# Altium project TX-10 Prototype.PrjPcb
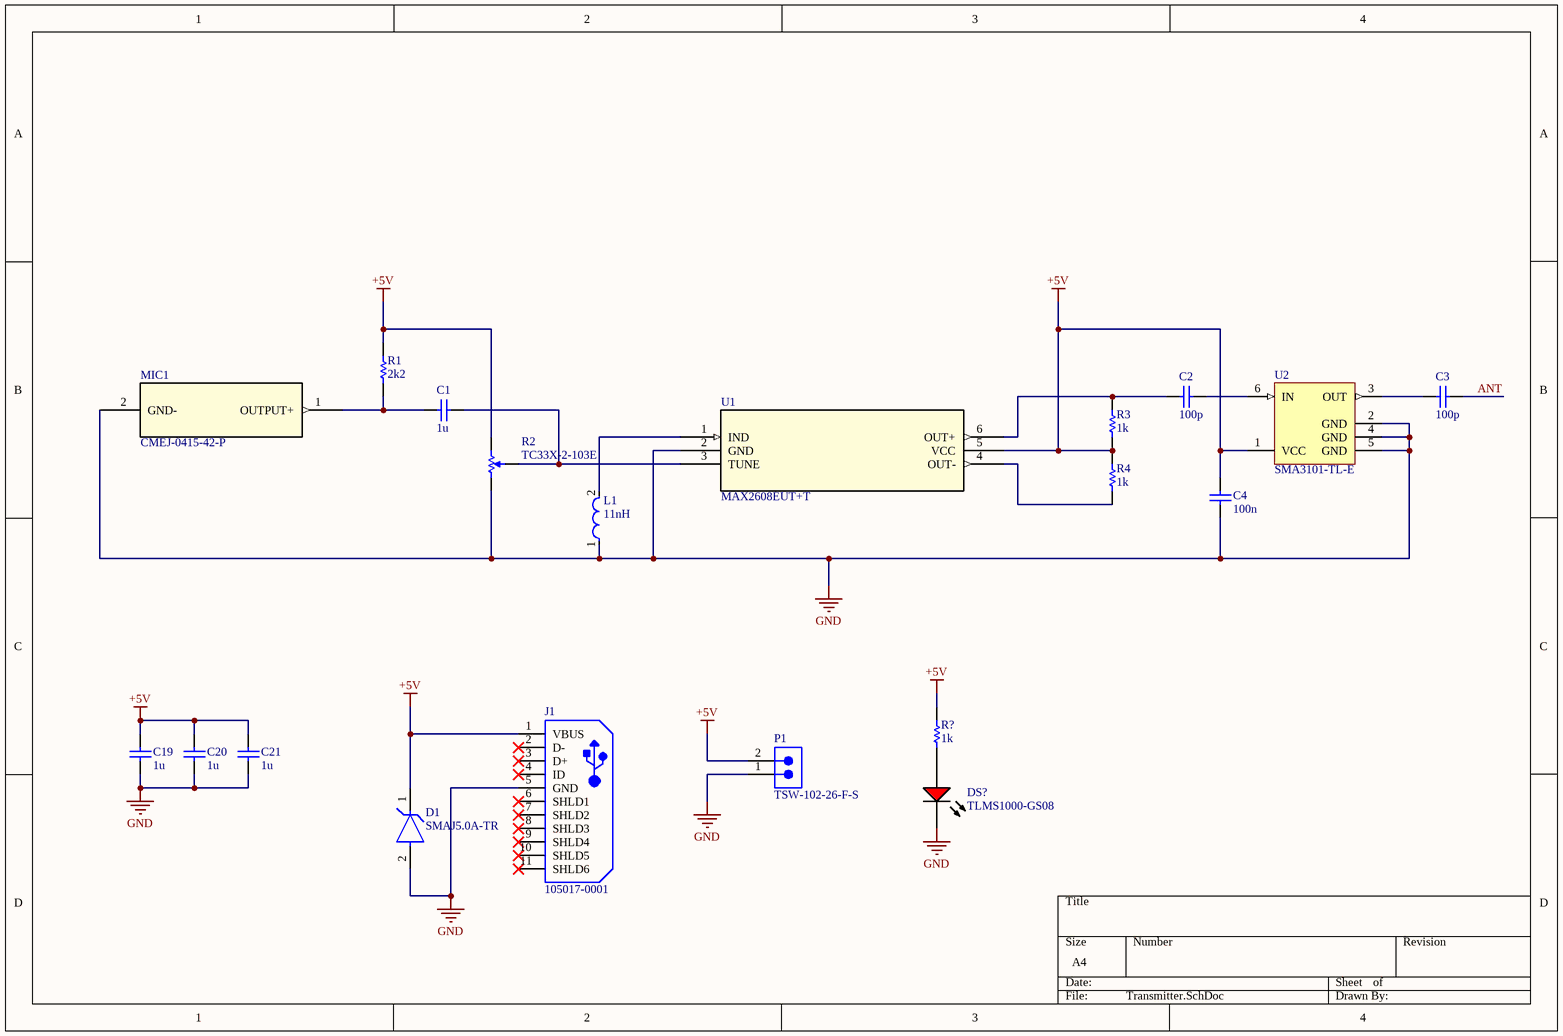
[diagram p0: Transmitter.SchDoc]
2 sheets, 64 parts. Net scope: global (net labels, ports and power ports of the same name join across sheets).
Board files: ReceiverPCB.PcbDoc, TransmitterPCB.PcbDoc
Sheets:
  Transmitter.SchDoc
  Receiver.SchDoc

## Sheet Transmitter.SchDoc
size A4; SheetNumber: 1; SheetTotal: 2

### Parts
C1  1u  [CAPC1608X90X35ML10T15]
C2  100p  [CAPC1608X90X35ML10T15]
C3  100p  [CAPC1608X90X35ML10T15]
C4  100n  [CAPC1608X90X35ML10T15]
C19  1u  [CAPC1608X90X35ML10T15]
C20  1u  [CAPC1608X90X35ML10T15]
C21  1u  [CAPC1608X90X35ML10T15]
D1  SMAJ5.0A-TR  [FP-SMA-MFG]
DS?  TLMS1000-GS08  [VISH-TLMS1000_V]
J1  105017-0001  [USB-MICRO-B_V]
L1  11nH  [FP-SRN2512-MFG]
MIC1  CMEJ-0415-42-P  [CMEJ-0415_CUD]
P1  TSW-102-26-F-S  [SMTC-TSW-102-26-XX-S]
R1  2k2  [RESC1608X55X25ML10T15]
R2  TC33X-2-103E  [BOUR-TC33X-2_V]
R3  1k  [RESC1608X55X25ML10T15]
R4  1k  [RESC1608X55X25ML10T15]
R?  1k  [RESC1608X55X25ML10T15]
U1  MAX2608EUT+T  [21-0058I_MXM]
U2  SMA3101-TL-E  [ONSC-MCPH-6_V]

### Nets
+5V: C4.2 C19.2 C20.2 C21.2 D1.1(K) J1.1(VBUS) P1.2 R1.2 R2.3 R3.1 R4.2 R?.1 U1.5(VCC) U2.1(VCC)
GND: C4.1 C19.1 C20.1 C21.1 D1.2(A) DS?.2(K) J1.5(GND) L1.1 MIC1.2(GND-) P1.1 R2.1 U1.2(GND) U2.2(GND) U2.4(GND) U2.5(GND)
ANT: C3.2
NetC1_1: C1.1 MIC1.1(OUTPUT+) R1.1
NetC1_2: C1.2 R2.2 U1.3(TUNE)
NetC2_1: C2.1 R3.2 U1.6(OUT+)
NetC2_2: C2.2 U2.6(IN)
NetC3_1: C3.1 U2.3(OUT)
NetDS?_1: DS?.1(A) R?.2
NetL1_2: L1.2 U1.1(IND)
NetR4_1: R4.1 U1.4(OUT-)

Not connected (* = marked no-connect by the designer): J1 2(D-)* 3(D+)* 4(ID)* 6(SHLD1)* 7(SHLD2)* 8(SHLD3)* 9(SHLD4)* 10(SHLD5)* 11(SHLD6)*

### Library data of the parts
C1-C4 C19-C21 = CMP-2100-03643-1: Chip Capacitor, 0.1 uF, +/- 10%, 50 V, -55 to 125 degC, 0603 (1608 Metric), RoHS, Tape and Reel; Manufacturer: Murata; Dielectric Material: Ceramic; Voltage Rating: 50V; Capacitance: 100nF; Dielectric: X7R; Insulation Resistance: 10GR; Case Code (Metric): 1608; Lead Free: LeadFree; Depth: 0.8mm; Number of Pins: 2; Radiation Hardening: No; Case/Package: 0603; Manufacturer URL: http://www.murata.com/; Packaging: TapeandReel; Length: 1.6mm; Contact Plating: Tin; Datasheet URL: http://psearch.en.murata.com/capacitor/product/GRM188R71H104KA93%23.pdf; Tolerance: 10%; Case Code (Imperial): 0603; Min Operating Temperature: -55degC; RoHSCompliant: true; Voltage: 50V; Termination: SMD/SMT; Mount: SurfaceMount; Material: Ceramic; Package Quantity: 1; Height: 0.8mm; Thickness: 0.035inch; REACH SVHC: NoSVHC; Max Operating Temperature: 125degC; Width: 0.8mm; Package Reference: 0603; Voltage Rating (DC): 50V; Datasheet Version: 42675.0; Package Description: 2-Pin Surface Mount Device, Body 1.6 x 0.8 mm
D1 = CMP-12225-000048-1: TVS DIODE 5V 13.4V SMA; Manufacturer: STMicroelectronics; Standoff Height: 0.05mm; Max Junction Temp: +150°C; Clamping Voltage: 9.2V; Number Of Channels: 1; Peak Pulse Power: 400W; Peak Pulse Current: 43.5A; Breakdown Voltage: 6.4V; Direction: Unidirectional; ComponentLink2Description: Datasheet; Lead Free: Yes; Package: SMA; Height: 2.65mm; Mouser Description: Transient Voltage Suppressor, TVS, Transil SMAJ Series, Unidirectional, 5 V, DO-214AC, 2, 6.4 V; Manufacturer Part Number: SMAJ5.0A-TR; Reverse Standoff Voltage: 5V; Temperature Range Low: -55°C; Device Class L1: Circuit Protection; RoHS: TRUE; Category: Diode; Automotive: No; ComponentLink2URL: https://www.st.com/resource/en/datasheet/smaj.pdf; Device Class L3: unset; Device Class L2: TVS Diodes; Temperature Range High: +150°C; Octopart: https://octopart.com/smaj5.0a-tr-stmicroelectronics-347063; Digikey Description: TVS DIODE 5V 13.4V SMA; Temperature: -55°C to +150°C
DS? = CMP-2000-07254-1: Low Current LED, 40 mW, 1.8 V, -40 to 100 degC, 2-Pin SMD (0603), RoHS, Tape and Reel; Manufacturer: Vishay; Lens Shape: Rectangular; Automotive Qualification Standard: AEC-Q100; Wavelength Typ: 636nm; SVHC: ToBeAdvised; LED Colour: Red; Bulb Size: 1.6mmx0.8mm; Forward Voltage: 1.8V; Luminous Intensity: 4mcd; Forward Current If: 2mA; Viewing Angle: 80°; Datasheet Version: Rev. 1.7, 02/2011; Datasheet URL: https://datasheet.ciiva.com/5798/1698881-5798337.pdf; LED Mounting: SMD; Packaging: CutTape; Package Reference: TLMS1000; Manufacturer URL: http://www.vishay.com/; Mounting Technology: SurfaceMount; Product Range: -; Package Description: 2-Pin Surface Mount Device, Body 1.6 x 0.8 mm; MSL: MSL2-1year
J1 = CMP-2000-05827-1: Micro-USB B Receptacle, Right Angle, Bottom Mount, Surface Mount, with Solder Tabs, -30 to 85 degC, 5-Pin USB, RoHS, Tape and Reel; Manufacturer: Molex; Featured Product: Micro-USBConnectorsUSBConnectors; Other Names: WM1399DKR; Package Version: Rev. F, 12/2012; Number of Contacts: 5; Connector Type: USB-microB; Catalog Drawings: 1050170001; 3D Model: 105017-0001.stp; Mating Products: WM17145-ND-CABLEMICROUSBBTOSTDA1.0MWM17147-ND-CABLEMICROUSBBTOSTDA2.0MWM17146-ND-CABLEMICROUSBBTOSTDA1.5M; PCN Assembly/Origin: ResinSupplier21/Oct/2015; Voltage - Max: 30V; Online Catalog: Molex-MicroUSB; Manufacturer URL: http://www.molex.com/; Package Description: 5-Leads USB, Micro B, Body 7.5 x 5 mm, Pitch 0.65 mm; Datasheet URL: http://www.molex.com/elqNow/elqRedir.htm?ref=http://www.molex.com/webdocs/datasheets/pdf/en-us/1050170001_IO_CONNECTORS.pdf; Ingress Protection: -; Datasheet Version: 03/2016; Mounting Type: BoardCutout,SurfaceMount,RightAngle; Circuits: 5; Standard Package: 1; Package Reference: MICRO-B; Package URL: http://www.molex.com/pdm_docs/sd/1050170001_sd.pdf; Category: Connectors,Interconnects; Series: -; RoHS Information: 1050170001CertofCompliance; Features: Shielded,SolderRetention; Family: USB,DVI,HDMIConnectors; Specifications: -; Gender: Receptacle; Packaging: Digi-Reel®; Mounting Technology: SurfaceMount
L1 = CMP-07248-000049-1: FIXED IND 240NH 4.7A 24 MOHM SMD; Inductance Tolerance: 20%; Core Material: Ferrite; Shielding: Shielded; Self Resonant Frequency: 330MHz; Test Frequency: 1MHz; DC Resistance (DCR): 24mR; Saturation Current: 8A; Package Quantity: 2000; Depth: 2mm; Case Code (Metric): 2520; Case Code (Imperial): 1008; Max DC Current: 4.7A; Width: 0.079inch; Weight: 0.001058oz; Current Rating: 4.7A; Tolerance: 20%; Mount: Surface Mount; Height - Seated (Max): 0.047inch; Min Operating Temperature: -55°C; Inductance: 240nH; RMS Current (Irms): 4.7A; REACH SVHC: No SVHC; Max Operating Temperature: 125°C; Length: 2.5mm; Packaging: Tape and Reel; Height: 1.2mm; Case/Package: 1008; Resistor Type: Wirewound; Termination: SMD/SMT; RoHS Compliant: Yes
MIC1 = CMEJ-0415-42-P: No Description Available; Mfr_Name: Same Sky; RefDes: RefDes; Type: Type
P1 = CMP-1024-00329-1: 0.025" SQ Post Header, Through-hole, Vertical, -55 to 125 degC, 2.54 mm Pitch, 2-Pin, Male, RoHS; Manufacturer: Samtec; Pitch: 2.54 mm; PackageVersion: DM, 8/1988; ComponentLink2Description: Datasheet; PackageReference: TSW-102-26-XX-S; ComponentLink3URL: http://www.samtec.com/documents/webfiles/cpdf/TSW-XXX-XX-XXX-X-XX-XXX-MKT.pdf; ComponentLink2URL: http://www.samtec.com/documents/webfiles/pdf/TSW_TH.PDF; ComponentLink1Description: Manufacturer URL; DatasheetVersion: F-214; RoHS: True; ComponentLink3Description: Package Specification; PartNumber: TSW-102-26-F-S; Temperature Range: -55 to 125 degC; Orientation: Vertical; ComponentLink1URL: http://www.samtec.com; PackageDescription: .025[0.64] SQ. Post Terminal Strip Assembly; Mounting Technology: Through-hole
R1 R3 R4 R? = CMP-2100-03667-1: Chip Resistor, 0 Ohm, +/- 5%, 0.1 W, -55 to 155 degC, 0603 (1608 Metric), RoHS, Tape and Reel; Manufacturer: Yageo; Temperature Coefficient: 200ppm/degreesC; Voltage Rating: 50V; Power Rating: 100mW; Resistance: 0mOhm; Width: 0.8mm; Max Operating Temperature: 155degC; Tolerance: 5%; Package Reference: 0603; Height: 0.45mm; Depth: 0.8mm; Package Description: 2-Pin Surface Mount Device, Body 1.6 x 0.8 mm; Termination: SMD/SMT; Package Quantity: 5000; Case/Package: 0603; Case Code (Imperial): 0603; Radiation Hardening: No; Number of Pins: 2; Length: 1.6mm; Lead Free: LeadFree; Voltage Rating (DC): 50V; Military Standard: Not; Datasheet URL: http://www.yageo.com/NewPortal/yageodocoutput?fileName=/pdf/R-Chip/PYu-RC_Group_51_RoHS_L_5.pdf; Manufacturer URL: http://www.yageo.com/; Packaging: TapeandReel; Case Code (Metric): 1608; Min Operating Temperature: -55degC; Composition: ThickFilm; RoHSCompliant: true; Contact Plating: Tin; Datasheet Version: Rev. 5, 10/2016; REACH SVHC: NoSVHC
R2 = CMP-2100-03695-1: Trimming Potentiometer, 10000 Ohm, -40 to 100 degC, 3-Pin SMD, RoHS, Tape and Reel; Manufacturer: Bourns; Tolerance: 25%; Max Power Dissipation: 100mW; Number of Turns: 1; Resistance: 10KOhm; Temperature Coefficient: 250ppm/degreesC; Voltage Rating (DC): 50V; Datasheet URL: http://www.bourns.com/docs/Product-Datasheets/TC33.pdf; Composition: Potentiometer; Package Description: 3-Pin Surface Mount Device, Body 3.8 x 3.6 mm; Weight: 29.4mg; Power Rating: 100mW; Termination: FootPrint; Manufacturer URL: http://www.bourns.com/; Width: 0.118inch; Height: 0.047inch; Military Standard: Not; Radiation Hardening: No; Colour: Silver; Case/Package: SMD/SMT; Depth: 3.8mm; Min Operating Temperature: -40degC; Lead Free: LeadFree; Datasheet Version: 42583.0; REACH SVHC: NoSVHC; Length: 3mm; RoHSCompliant: true; Contact Plating: Silver; Taper: Linear; Packaging: TapeandReel; Mount: SurfaceMount; Max Operating Temperature: 100degC; Package Reference: TC33X-2; Package Quantity: 2500
U1 = MAX2608EUT+T: No Description Available; Mfr_Name: Analog Devices / Maxim Integrated; RefDes: RefDes; Type: Type
U2 = CMP-1314-00002-1: MMIC, Amplifier, 5 V, 10 mA, 0.1 to 3 GHz, 4.5 to 5.5 V, -40 to 85 degC, 6-Pin MCPH, Pb-Free, Tape and Reel; Manufacturer: On Semiconductor; Power Gain Min (dB): 21.5; Upper Freq (3 dB) (GHz): 3; ICC Min (mA): 7.1; VCC Min (V): 4.5; Power Gain Max (dB): 28.5; ICC Max (mA): 12.6; VCC Max (V): 5.5; Noise Figure Max (dB): 5.3; ComponentLink3Description: Package Specification; ComponentLink3URL: http://www.onsemi.com/pub_link/Collateral/ENA1601-D.PDF; PackageDescription: 6-Pin Small Outline Transistor, Body 2 x 1.6 mm, Pitch 0.65 mm; PartNumber: SMA3101-TL-E; ComponentLink2Description: Datasheet; ComponentLink2URL: http://www.onsemi.com/pub_link/Collateral/ENA1431A-D.PDF; RoHS: TRUE; Packing: Tape and Reel; ComponentLink1URL: http://www.onsemi.com/; Mounting Technology: Surface Mount; ComponentLink1Description: Manufacturer URL; PackageReference: MCPH-6; DatasheetVersion: Rev. 1

## Sheet Receiver.SchDoc
size A4; SheetNumber: 2; SheetTotal: 2
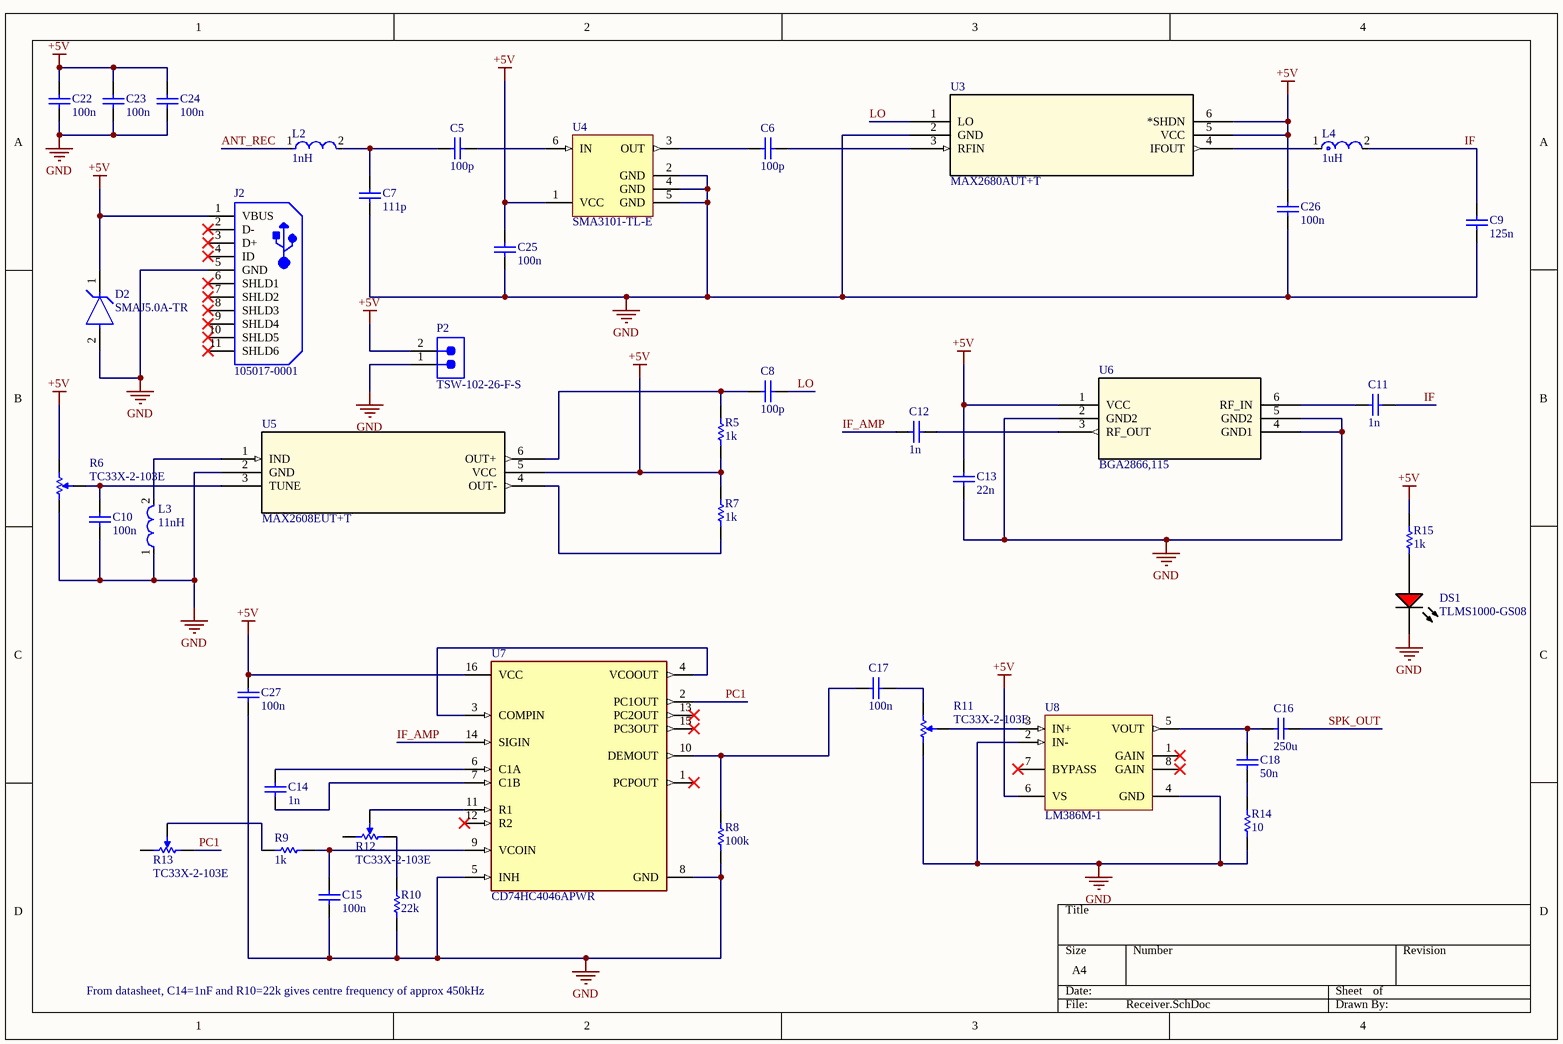
[diagram p1: Receiver.SchDoc]

### Parts
C5  100p  [CAPC1608X90X35ML10T15]
C6  100p  [CAPC1608X90X35ML10T15]
C7  111p  [CAPC1608X90X35ML10T15]
C8  100p  [CAPC1608X90X35ML10T15]
C9  125n  [CAPC1608X90X35ML10T15]
C10  100n  [CAPC1608X90X35ML10T15]
C11  1n  [CAPC1608X90X35ML10T15]
C12  1n  [CAPC1608X90X35ML10T15]
C13  22n  [CAPC1608X90X35ML10T15]
C14  1n  [CAPC1608X90X35ML10T15]
C15  100n  [CAPC1608X90X35ML10T15]
C16  250u  [CAPC1608X90X35ML10T15]
C17  100n  [CAPC1608X90X35ML10T15]
C18  50n  [CAPC1608X90X35ML10T15]
C22  100n  [CAPC1608X90X35ML10T15]
C23  100n  [CAPC1608X90X35ML10T15]
C24  100n  [CAPC1608X90X35ML10T15]
C25  100n  [CAPC1608X90X35ML10T15]
C26  100n  [CAPC1608X90X35ML10T15]
C27  100n  [CAPC1608X90X35ML10T15]
D2  SMAJ5.0A-TR  [FP-SMA-MFG]
DS1  TLMS1000-GS08  [VISH-TLMS1000_V]
J2  105017-0001  [USB-MICRO-B_V]
L2  1nH  [FP-SRN2512-MFG]
L3  11nH  [FP-SRN2512-MFG]
L4  1uH  [FP-LQG18HH_00-IPC_A]
P2  TSW-102-26-F-S  [SMTC-TSW-102-26-XX-S]
R5  1k  [RESC1608X55X25ML10T15]
R6  TC33X-2-103E  [BOUR-TC33X-2_V]
R7  1k  [RESC1608X55X25ML10T15]
R8  100k  [RESC1608X55X25ML10T15]
R9  1k  [RESC1608X55X25ML10T15]
R10  22k  [RESC1608X55X25ML10T15]
R11  TC33X-2-103E  [BOUR-TC33X-2_V]
R12  TC33X-2-103E  [BOUR-TC33X-2_V]
R13  TC33X-2-103E  [BOUR-TC33X-2_V]
R14  10  [RESC1608X55X25ML10T15]
R15  1k  [RESC1608X55X25ML10T15]
U3  MAX2680AUT+T  [21-0058I_MXM]
U4  SMA3101-TL-E  [ONSC-MCPH-6_V]
U5  MAX2608EUT+T  [21-0058I_MXM]
U6  BGA2866,115  [SOT_2815,115_NXP]
U7  CD74HC4046APWR  [FP-PW0016A-IPC_C]
U8  LM386M-1  [D0008A_M]

### Nets
+5V: C13.2 C22.2 C23.2 C24.2 C25.2 C26.2 C27.2 D2.1(K) J2.1(VBUS) P2.2 R5.1 R6.3 R7.2 R15.1 U3.5(VCC) U3.6(*SHDN) U4.1(VCC) U5.5(VCC) U6.1(VCC) U7.16(VCC) U8.6(VS)
GND: C7.1 C9.1 C10.1 C13.1 C15.1 C22.1 C23.1 C24.1 C25.1 C26.1 C27.1 D2.2(A) DS1.2(K) J2.5(GND) L3.1 P2.1 R6.1 R8.2 R10.2 R11.1 R14.2 U3.2(GND) U4.2(GND) U4.4(GND) U4.5(GND) U5.2(GND) U6.2(GND2) U6.4(GND1) U6.5(GND2) U7.5(INH) U7.8(GND) U8.2(IN-) U8.4(GND)
ANT_REC: L2.1
IF: C9.2 C11.2 L4.2
IF_AMP: C12.1 U7.14(SIGIN)
LO: C8.2 U3.1(LO)
PC1: R13.1 U7.2(PC1OUT)
SPK_OUT: C16.2
NetC5_1: C5.1 C7.2 L2.2
NetC5_2: C5.2 U4.6(IN)
NetC6_1: C6.1 U4.3(OUT)
NetC6_2: C6.2 U3.3(RFIN)
NetC8_1: C8.1 R5.2 U5.6(OUT+)
NetC10_2: C10.2 R6.2 U5.3(TUNE)
NetC11_1: C11.1 U6.6(RF_IN)
NetC12_2: C12.2 U6.3(RF_OUT)
NetC14_1: C14.1 U7.7(C1B)
NetC14_2: C14.2 U7.6(C1A)
NetC15_2: C15.2 R9.1 U7.9(VCOIN)
NetC16_1: C16.1 C18.2 U8.5(VOUT)
NetC17_1: C17.1 R8.1 U7.10(DEMOUT)
NetC17_2: C17.2 R11.3
NetC18_1: C18.1 R14.1
NetDS1_1: DS1.1(A) R15.2
NetL3_2: L3.2 U5.1(IND)
NetL4_1: L4.1 U3.4(IFOUT)
NetR7_1: R7.1 U5.4(OUT-)
NetR9_2: R9.2 R13.2
NetR10_1: R10.1 R12.1
NetR11_2: R11.2 U8.3(IN+)
NetR12_2: R12.2 U7.11(R1)
NetU7_3: U7.3(COMPIN) U7.4(VCOOUT)

Not connected (* = marked no-connect by the designer): J2 2(D-)* 3(D+)* 4(ID)* 6(SHLD1)* 7(SHLD2)* 8(SHLD3)* 9(SHLD4)* 10(SHLD5)* 11(SHLD6)*; R12 3; R13 3; U7 1(PCPOUT)* 12(R2)* 13(PC2OUT)* 15(PC3OUT)*; U8 1(GAIN)* 7(BYPASS)* 8(GAIN)*

### Notes on the sheet
- From datasheet, C14=1nF and R10=22k gives centre frequency of approx 450kHz

### Library data of the parts
C5-C18 C22-C27 = CMP-2100-03643-1: as C1 on sheet Transmitter; Case Code (Metric): 1608; Lead Free: LeadFree; Depth: 0.8mm; Number of Pins: 2; Radiation Hardening: No; Case/Package: 0603; Manufacturer URL: http://www.murata.com/; Packaging: TapeandReel; Length: 1.6mm; Contact Plating: Tin; Datasheet URL: http://psearch.en.murata.com/capacitor/product/GRM188R71H104KA93%23.pdf; Tolerance: 10%; Case Code (Imperial): 0603; Min Operating Temperature: -55degC; RoHSCompliant: true; Voltage: 50V; Termination: SMD/SMT; Mount: SurfaceMount; Material: Ceramic; Package Quantity: 1; Height: 0.8mm; Thickness: 0.035inch; REACH SVHC: NoSVHC; Max Operating Temperature: 125degC; Width: 0.8mm; Package Reference: 0603; Voltage Rating (DC): 50V; Datasheet Version: 42675.0; Package Description: 2-Pin Surface Mount Device, Body 1.6 x 0.8 mm
D2 = CMP-12225-000048-1: as D1 on sheet Transmitter; ComponentLink2Description: Datasheet; Lead Free: Yes; Package: SMA; Height: 2.65mm; Mouser Description: Transient Voltage Suppressor, TVS, Transil SMAJ Series, Unidirectional, 5 V, DO-214AC, 2, 6.4 V; Manufacturer Part Number: SMAJ5.0A-TR; Reverse Standoff Voltage: 5V; Temperature Range Low: -55°C; Device Class L1: Circuit Protection; RoHS: TRUE; Category: Diode; Automotive: No; ComponentLink2URL: https://www.st.com/resource/en/datasheet/smaj.pdf; Device Class L3: unset; Device Class L2: TVS Diodes; Temperature Range High: +150°C; Octopart: https://octopart.com/smaj5.0a-tr-stmicroelectronics-347063; Digikey Description: TVS DIODE 5V 13.4V SMA; Temperature: -55°C to +150°C
DS1 = CMP-2000-07254-1: as DS? on sheet Transmitter; Datasheet Version: Rev. 1.7, 02/2011; Datasheet URL: https://datasheet.ciiva.com/5798/1698881-5798337.pdf; LED Mounting: SMD; Packaging: CutTape; Package Reference: TLMS1000; Manufacturer URL: http://www.vishay.com/; Mounting Technology: SurfaceMount; Product Range: -; Package Description: 2-Pin Surface Mount Device, Body 1.6 x 0.8 mm; MSL: MSL2-1year
J2 = CMP-2000-05827-1: as J1 on sheet Transmitter; Manufacturer URL: http://www.molex.com/; Package Description: 5-Leads USB, Micro B, Body 7.5 x 5 mm, Pitch 0.65 mm; Datasheet URL: http://www.molex.com/elqNow/elqRedir.htm?ref=http://www.molex.com/webdocs/datasheets/pdf/en-us/1050170001_IO_CONNECTORS.pdf; Ingress Protection: -; Datasheet Version: 03/2016; Mounting Type: BoardCutout,SurfaceMount,RightAngle; Circuits: 5; Standard Package: 1; Package Reference: MICRO-B; Package URL: http://www.molex.com/pdm_docs/sd/1050170001_sd.pdf; Category: Connectors,Interconnects; Series: -; RoHS Information: 1050170001CertofCompliance; Features: Shielded,SolderRetention; Family: USB,DVI,HDMIConnectors; Specifications: -; Gender: Receptacle; Packaging: Digi-Reel®; Mounting Technology: SurfaceMount
L2 L3 = CMP-07248-000049-1: as L1 on sheet Transmitter; Package Quantity: 2000; Depth: 2mm; Case Code (Metric): 2520; Case Code (Imperial): 1008; Max DC Current: 4.7A; Width: 0.079inch; Weight: 0.001058oz; Current Rating: 4.7A; Tolerance: 20%; Mount: Surface Mount; Height - Seated (Max): 0.047inch; Min Operating Temperature: -55°C; Inductance: 240nH; RMS Current (Irms): 4.7A; REACH SVHC: No SVHC; Max Operating Temperature: 125°C; Length: 2.5mm; Packaging: Tape and Reel; Height: 1.2mm; Case/Package: 1008; Resistor Type: Wirewound; Termination: SMD/SMT; RoHS Compliant: Yes
L4 = CMP-06042-006288-1: Multilayer type RF Inductor 2.2nH ±0.3nH 0.1Ω 1100mA 0603; Max DC Current: 500mA; Core Material: Air; Self Resonant Frequency: 6GHz; Q Factor: 12; DC Resistance (DCR): 100mR; Shielding: Unshielded; Test Frequency: 100MHz; Inductance: 2.2nH; Depth: 0.95mm; Current Rating: 500mA; Packaging: Tape and Reel; Case/Package: 0603; Height - Seated (Max): 0.037inch; Mount: Surface Mount; Radiation Hardening: No; Max Operating Temperature: 85°C; Length: 0.063inch; Termination: SMD/SMT; Lead Free: Lead Free; Min Operating Temperature: -40°C; Number of Pins: 2; Case Code (Metric): 1608; Height: 0.8mm; REACH SVHC: No SVHC; Package Quantity: 4000; DC Current: 500mA; Width: 0.031inch; Military Standard: Not; Case Code (Imperial): 0603
P2 = CMP-1024-00329-1: as P1 on sheet Transmitter; PackageVersion: DM, 8/1988; ComponentLink2Description: Datasheet; PackageReference: TSW-102-26-XX-S; ComponentLink3URL: http://www.samtec.com/documents/webfiles/cpdf/TSW-XXX-XX-XXX-X-XX-XXX-MKT.pdf; ComponentLink2URL: http://www.samtec.com/documents/webfiles/pdf/TSW_TH.PDF; ComponentLink1Description: Manufacturer URL; DatasheetVersion: F-214; RoHS: True; ComponentLink3Description: Package Specification; PartNumber: TSW-102-26-F-S; Temperature Range: -55 to 125 degC; Orientation: Vertical; ComponentLink1URL: http://www.samtec.com; PackageDescription: .025[0.64] SQ. Post Terminal Strip Assembly; Mounting Technology: Through-hole
R5 R7-R10 R14 R15 = CMP-2100-03667-1: as R1 on sheet Transmitter; Width: 0.8mm; Max Operating Temperature: 155degC; Tolerance: 5%; Package Reference: 0603; Height: 0.45mm; Depth: 0.8mm; Package Description: 2-Pin Surface Mount Device, Body 1.6 x 0.8 mm; Termination: SMD/SMT; Package Quantity: 5000; Case/Package: 0603; Case Code (Imperial): 0603; Radiation Hardening: No; Number of Pins: 2; Length: 1.6mm; Lead Free: LeadFree; Voltage Rating (DC): 50V; Military Standard: Not; Datasheet URL: http://www.yageo.com/NewPortal/yageodocoutput?fileName=/pdf/R-Chip/PYu-RC_Group_51_RoHS_L_5.pdf; Manufacturer URL: http://www.yageo.com/; Packaging: TapeandReel; Case Code (Metric): 1608; Min Operating Temperature: -55degC; Composition: ThickFilm; RoHSCompliant: true; Contact Plating: Tin; Datasheet Version: Rev. 5, 10/2016; REACH SVHC: NoSVHC
R6 R11-R13 = CMP-2100-03695-1: as R2 on sheet Transmitter; Datasheet URL: http://www.bourns.com/docs/Product-Datasheets/TC33.pdf; Composition: Potentiometer; Package Description: 3-Pin Surface Mount Device, Body 3.8 x 3.6 mm; Weight: 29.4mg; Power Rating: 100mW; Termination: FootPrint; Manufacturer URL: http://www.bourns.com/; Width: 0.118inch; Height: 0.047inch; Military Standard: Not; Radiation Hardening: No; Colour: Silver; Case/Package: SMD/SMT; Depth: 3.8mm; Min Operating Temperature: -40degC; Lead Free: LeadFree; Datasheet Version: 42583.0; REACH SVHC: NoSVHC; Length: 3mm; RoHSCompliant: true; Contact Plating: Silver; Taper: Linear; Packaging: TapeandReel; Mount: SurfaceMount; Max Operating Temperature: 100degC; Package Reference: TC33X-2; Package Quantity: 2500
U3 = MAX2680AUT+T: No Description Available; Mfr_Name: Analog Devices / Maxim Integrated; RefDes: RefDes; Type: Type
U4 = CMP-1314-00002-1: as U2 on sheet Transmitter; ComponentLink3Description: Package Specification; ComponentLink3URL: http://www.onsemi.com/pub_link/Collateral/ENA1601-D.PDF; PackageDescription: 6-Pin Small Outline Transistor, Body 2 x 1.6 mm, Pitch 0.65 mm; PartNumber: SMA3101-TL-E; ComponentLink2Description: Datasheet; ComponentLink2URL: http://www.onsemi.com/pub_link/Collateral/ENA1431A-D.PDF; RoHS: TRUE; Packing: Tape and Reel; ComponentLink1URL: http://www.onsemi.com/; Mounting Technology: Surface Mount; ComponentLink1Description: Manufacturer URL; PackageReference: MCPH-6; DatasheetVersion: Rev. 1
U5 = MAX2608EUT+T: as U1 on sheet Transmitter; RefDes: RefDes; Type: Type
U6 = BGA2815,115: No Description Available; Mfr_Name: NXP; RefDes: RefDes; Type: Type
U7 = CMP-0776-00067-4: IC PLL W/VCO 16-TSSOP; Max Supply Voltage: 6V; Number of Circuits: 1; Supply Current: 8uA; Max Frequency: 38MHz; Min Supply Voltage: 2V; Frequency: 18MHz; Input: CMOS; PLL: Yes; REACH SVHC: No SVHC; Height: 1.15mm; Series: 74HC; Min Operating Temperature: -55°C; Case/Package: TSSOP; Package Quantity: 2000; Length: 5mm; Nominal Supply Current: 8uA; Lead Free: Lead Free; Packaging: Tape and Reel; RoHS Compliant: Yes; Max Operating Temperature: 125°C; Number of Pins: 16; Weight: 0.002183oz; Number of Bits: 1; Width: 4.4mm; Mount: Surface Mount; Contact Plating: Gold; Number of Elements: 1; Radiation Hardening: No
U8 = CMP-0057-00421-4: Low Voltage Audio Power Amplifier, 8-pin Narrow SOIC; Manufacturer: Texas Instruments; PackageTopMarking: NSZXTT*LM386*M-1; CompType: Audio IC; PowerWise: N; ComponentLink1Description: Datasheet URL; Code_IPC: SOIC127P600-8; PackageDescription: SOIC Narrow, 4.9 x 3.9 x 1.45mm, 8 Lead, 1.27mm Pitch; Code_JEDEC: MS-012-AA; PinCount: 8; ComponentLink1URL: http://www.ti.com/general/docs/lit/getliterature.tsp?genericPartNumber=LM386&fileType=pdf; RoHS: N; PackageReference: D0008A

## Nets that join several sheets
+5V: Transmitter (14 pins), Receiver (21 pins)
GND: Transmitter (15 pins), Receiver (33 pins)